# EAGLE design hand-pcb (EAGLE 7.3.0)
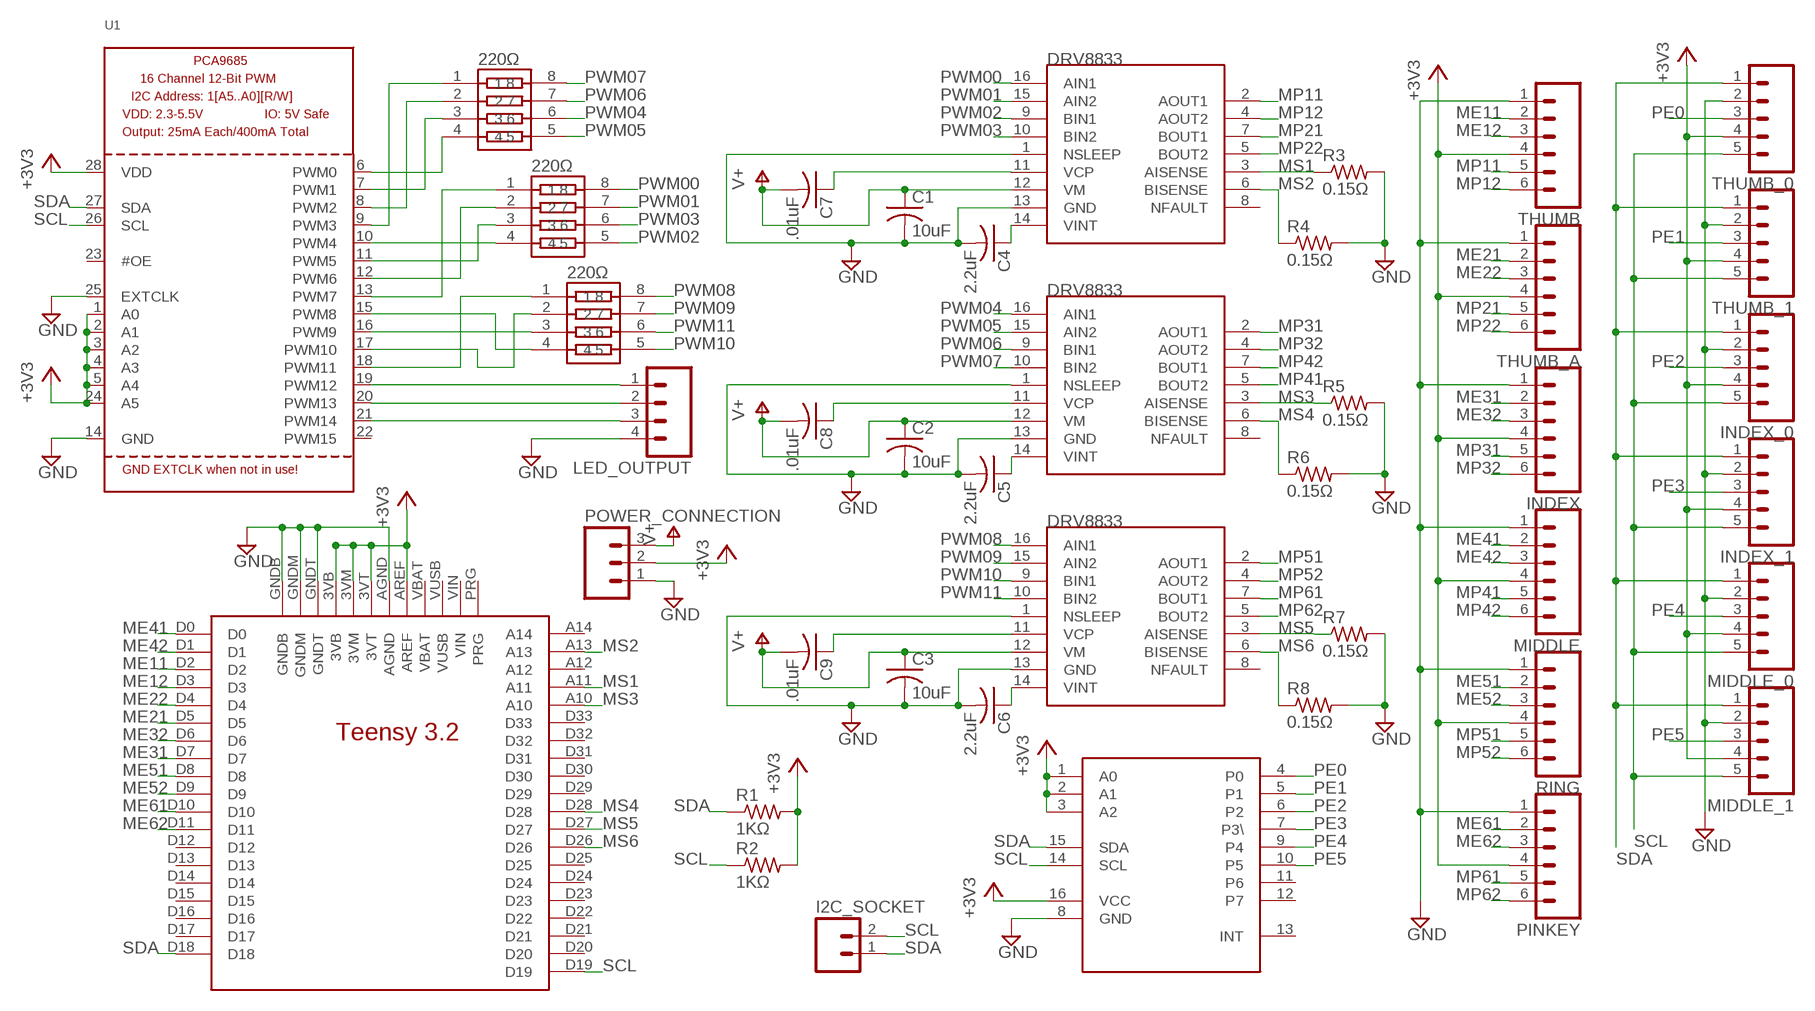
[diagram p0: schematic, sheet 1]

## Parts
220Ω  220Ω  RP164PJ221CS  [RP164PJ221CS]
C1  10uF  C-USC0603  [C0603]
C2  10uF  C-USC0603  [C0603]
C3  10uF  C-USC0603  [C0603]
C4  2.2uF  C-USC0603  [C0603]
C5  2.2uF  C-USC0603  [C0603]
C6  2.2uF  C-USC0603  [C0603]
C7  .01uF  C-USC0603  [C0603]
C8  .01uF  C-USC0603  [C0603]
C9  .01uF  C-USC0603  [C0603]
I2C_SOCKET  M02PTH  [1X02]
INDEX  M06POGOPIN_HOLES_ONLY  [1X06_HOLES_ONLY]
INDEX_0  M05  [1X05_HOLES_ONLY]
INDEX_1  M05  [1X05_HOLES_ONLY]
LED_OUTPUT  M04PTH  [1X04]
MIDDLE  M06POGOPIN_HOLES_ONLY  [1X06_HOLES_ONLY]
MIDDLE_0  M05  [1X05_HOLES_ONLY]
MIDDLE_1  M05  [1X05_HOLES_ONLY]
PINKEY  M06POGOPIN_HOLES_ONLY  [1X06_HOLES_ONLY]
POWER_CONNECTION  M03PTH  [1X03]
R1  1KΩ  R-US_R0603  [R0603]
R2  1KΩ  R-US_R0603  [R0603]
R3  0.15Ω  R-US_M1206  [M1206]
R4  0.15Ω  R-US_M1206  [M1206]
R5  0.15Ω  R-US_M1206  [M1206]
R6  0.15Ω  R-US_M1206  [M1206]
R7  0.15Ω  R-US_M1206  [M1206]
R8  0.15Ω  R-US_M1206  [M1206]
RING  M06POGOPIN_HOLES_ONLY  [1X06_HOLES_ONLY]
THUMB  M06POGOPIN_HOLES_ONLY  [1X06_HOLES_ONLY]
THUMB_0  M05  [1X05_HOLES_ONLY]
THUMB_1  M05  [1X05_HOLES_ONLY]
THUMB_A  M06POGOPIN_HOLES_ONLY  [1X06_HOLES_ONLY]
U1  PCA9685  [TSSOP28]
U$1  DRV8833  [TSSOP16]
U$2  DRV8833  [TSSOP16]
U$3  DRV8833  [TSSOP16]
U$4  TEENSY32  [TEENSY32]
U$5  TCA9534TSS  [TSSOP16]
U$7  220Ω  RP164PJ221CS  [RP164PJ221CS]
U$8  220Ω  RP164PJ221CS  [RP164PJ221CS]

## Nets
+3V3: INDEX.4 INDEX_0.4 INDEX_1.4 MIDDLE.4 MIDDLE_0.4 MIDDLE_1.4 PINKEY.4 POWER_CONNECTION.2 R1.2 R2.2 RING.4 THUMB.4 THUMB_0.4 THUMB_1.4 THUMB_A.4 U1.1(A0) U1.2(A1) U1.3(A2) U1.4(A3) U1.5(A4) U1.24(A5) U1.28(VDD) U$4.3VB U$4.3VM U$4.3VT U$4.AREF U$5.1(A0) U$5.2(A1) U$5.3(A2) U$5.16(VCC)
GND: C1.2 C2.2 C3.2 C4.2 C5.2 C6.2 INDEX.1 INDEX_0.2 INDEX_1.2 LED_OUTPUT.4 MIDDLE.1 MIDDLE_0.2 MIDDLE_1.2 PINKEY.1 POWER_CONNECTION.1 R3.2 R4.2 R5.2 R6.2 R7.2 R8.2 RING.1 THUMB.1 THUMB_0.2 THUMB_1.2 THUMB_A.1 U1.14(GND) U1.25(EXTCLK) U$1.1(NSLEEP) U$1.13(GND) U$2.1(NSLEEP) U$2.13(GND) U$3.1(NSLEEP) U$3.13(GND) U$4.AGND U$4.GNDB U$4.GNDM U$4.GNDT U$5.8(GND)
ME11: THUMB.2 U$4.D2
ME12: THUMB.3 U$4.D3
ME21: THUMB_A.2 U$4.D5
ME22: THUMB_A.3 U$4.D4
ME31: INDEX.2 U$4.D7
ME32: INDEX.3 U$4.D6
ME41: MIDDLE.2 U$4.D0
ME42: MIDDLE.3 U$4.D1
ME51: RING.2 U$4.D8
ME52: RING.3 U$4.D9
ME61: PINKEY.2 U$4.D10
ME62: PINKEY.3 U$4.D11
MP11: THUMB.5 U$1.2(AOUT1)
MP12: THUMB.6 U$1.4(AOUT2)
MP21: THUMB_A.5 U$1.7(BOUT1)
MP22: THUMB_A.6 U$1.5(BOUT2)
MP31: INDEX.5 U$2.2(AOUT1)
MP32: INDEX.6 U$2.4(AOUT2)
MP41: MIDDLE.5 U$2.5(BOUT2)
MP42: MIDDLE.6 U$2.7(BOUT1)
MP51: RING.5 U$3.2(AOUT1)
MP52: RING.6 U$3.4(AOUT2)
MP61: PINKEY.5 U$3.7(BOUT1)
MP62: PINKEY.6 U$3.5(BOUT2)
MS1: R3.1 U$1.3(AISENSE) U$4.A11
MS2: R4.1 U$1.6(BISENSE) U$4.A13
MS3: R5.1 U$2.3(AISENSE) U$4.A10
MS4: R6.1 U$2.6(BISENSE) U$4.D28
MS5: R7.1 U$3.3(AISENSE) U$4.D27
MS6: R8.1 U$3.6(BISENSE) U$4.D26
N$1: 220Ω.4 U1.6(PWM0)
N$2: 220Ω.3 U1.7(PWM1)
N$3: 220Ω.2 U1.8(PWM2)
N$4: 220Ω.1 U1.9(PWM3)
N$5: U1.10(PWM4) U$7.4
N$6: U1.11(PWM5) U$7.3
N$7: U1.12(PWM6) U$7.2
N$8: U1.13(PWM7) U$7.1
N$9: U1.15(PWM8) U$8.4
N$10: U1.16(PWM9) U$8.3
N$11: U1.17(PWM10) U$8.2
N$12: U1.18(PWM11) U$8.1
N$14: C7.1 U$1.11(VCP)
N$15: C8.1 U$2.11(VCP)
N$16: C9.1 U$3.11(VCP)
N$17: LED_OUTPUT.1 U1.19(PWM12)
N$18: LED_OUTPUT.2 U1.20(PWM13)
N$19: LED_OUTPUT.3 U1.21(PWM14)
N$25: C4.1 U$1.14(VINT)
N$28: C5.1 U$2.14(VINT)
N$33: C6.1 U$3.14(VINT)
PE0: THUMB_0.3 U$5.4(P0)
PE1: THUMB_1.3 U$5.5(P1)
PE2: INDEX_0.3 U$5.6(P2)
PE3: INDEX_1.3 U$5.7(P3\)
PE4: MIDDLE_0.3 U$5.9(P4)
PE5: MIDDLE_1.3 U$5.10(P5)
PWM00: U$1.16(AIN1) U$7.8
PWM01: U$1.15(AIN2) U$7.7
PWM02: U$1.9(BIN1) U$7.5
PWM03: U$1.10(BIN2) U$7.6
PWM04: 220Ω.6 U$2.16(AIN1)
PWM05: 220Ω.5 U$2.15(AIN2)
PWM06: 220Ω.7 U$2.9(BIN1)
PWM07: 220Ω.8 U$2.10(BIN2)
PWM08: U$3.16(AIN1) U$8.8
PWM09: U$3.15(AIN2) U$8.7
PWM10: U$3.9(BIN1) U$8.5
PWM11: U$3.10(BIN2) U$8.6
SCL: I2C_SOCKET.2 INDEX_0.5 INDEX_1.5 MIDDLE_0.5 MIDDLE_1.5 R2.1 THUMB_0.5 THUMB_1.5 U1.26(SCL) U$4.D19 U$5.14(SCL)
SDA: I2C_SOCKET.1 INDEX_0.1 INDEX_1.1 MIDDLE_0.1 MIDDLE_1.1 R1.1 THUMB_0.1 THUMB_1.1 U1.27(SDA) U$4.D18 U$5.15(SDA)
V+: C1.1 C2.1 C3.1 C7.2 C8.2 C9.2 POWER_CONNECTION.3 U$1.12(VM) U$2.12(VM) U$3.12(VM)
Unconnected: U1.22(PWM15) U1.23(#OE) U$1.8(NFAULT) U$2.8(NFAULT) U$3.8(NFAULT) U$4.A12 U$4.A14 U$4.D12 U$4.D13 U$4.D14 U$4.D15 U$4.D16 U$4.D17 U$4.D20 U$4.D21 U$4.D22 U$4.D23 U$4.D24 U$4.D25 U$4.D29 U$4.D30 U$4.D31 U$4.D32 U$4.D33 U$5.11(P6) U$5.12(P7) U$5.13(INT)

## Power pins joined to a net without a drawn wire
PRG: U$4.PRG
VBAT: U$4.VBAT
VIN: U$4.VIN
VUSB: U$4.VUSB

## Library data of the parts
220Ω U$7 U$8 = resistor-net1:RP164PJ221CS
C1-C9 = resistor:C-US: CAPACITOR, American symbol
I2C_SOCKET = SparkFun1:M02: Header 2 Standard 2-pin 0.1" header. Use with straight break away headers (SKU : PRT-00116), right angle break away headers (PRT-00553), swiss pins (PRT-00743), machine pins (PRT-00117), and female headers (PRT-00115). Molex polarized connector foot print use with SKU : PRT-08233 with associated crimp pins and housings.
INDEX MIDDLE PINKEY RING THUMB THUMB_A = SparkFun:M06: Header 6 Standard 6-pin 0.1" header. Use with straight break away headers (SKU : PRT-00116), right angle break away headers (PRT-00553), swiss pins (PRT-00743), machine pins (PRT-00117), and female headers (PRT-00115). Molex polarized connector foot print use with SKU : PRT-08094 with associated crimp pins and housings. NOTES ON THE VARIANTS LOCK and LOCK_LONGPADS... This footprint was designed to help hold the alignment of a through-hole component (i.e. 6-pin header) while soldering it into place. You may notice that each hole has been shifted either up or down by 0.005 of an inch from it's more standard position (which is a perfectly straight line). This slight alteration caused the pins (the squares in the middle) to touch the edges of the holes. Because they are alternating, it causes a "brace" to hold the component in place. 0.005 has proven to be the perfect amount of "off-center" position when using our standard breakaway headers. Although looks a little odd when you look at the bare footprint, once you have a header in there, the alteration is very hard to notice. Also, if you push a header all the way into place, it is covered up entirely on the bottom side. This idea of altering the position of holes to aid alignment will be further integrated into the Sparkfun Library for other footprints. It can help hold any component with 3 or more connection pins.
INDEX_0 INDEX_1 MIDDLE_0 MIDDLE_1 THUMB_0 THUMB_1 = SparkFun1:M05: Header 5 Standard 5-pin 0.1" header. Use with straight break away headers (SKU : PRT-00116), right angle break away headers (PRT-00553), swiss pins (PRT-00743), machine pins (PRT-00117), and female headers (PRT-00115). Molex polarized connector foot print use with SKU : PRT-08230 with associated crimp pins and housings.
LED_OUTPUT = SparkFun1:M04: Header 4 Standard 4-pin 0.1" header. Use with straight break away headers (SKU : PRT-00116), right angle break away headers (PRT-00553), swiss pins (PRT-00743), machine pins (PRT-00117), and female headers (PRT-00115). Molex polarized connector foot print use with SKU : PRT-08231 with associated crimp pins and housings. 1MM SMD Version SKU: PRT-10208
POWER_CONNECTION = SparkFun1:M03: Header 3 Standard 3-pin 0.1" header. Use with straight break away headers (SKU : PRT-00116), right angle break away headers (PRT-00553), swiss pins (PRT-00743), machine pins (PRT-00117), and female headers (PRT-00115). Molex polarized connector foot print use with SKU : PRT-08232 with associated crimp pins and housings.
R1-R8 = resistor:R-US_: RESISTOR, American symbol
U1 = adafruit:PCA9685: PCA9685 - 16 Channel 12-Bit I2C PWM Controller 5.0V tolerant 16 channel, 12-bit I2C PWM controller with 25mA per output (max. 400mA total) Digikey: 568-5931-1-ND
U$1-U$3 = texas1:DRV8833
U$4 = SparkFun:TEENSY32
U$5 = texas1:TCA9534

## Board
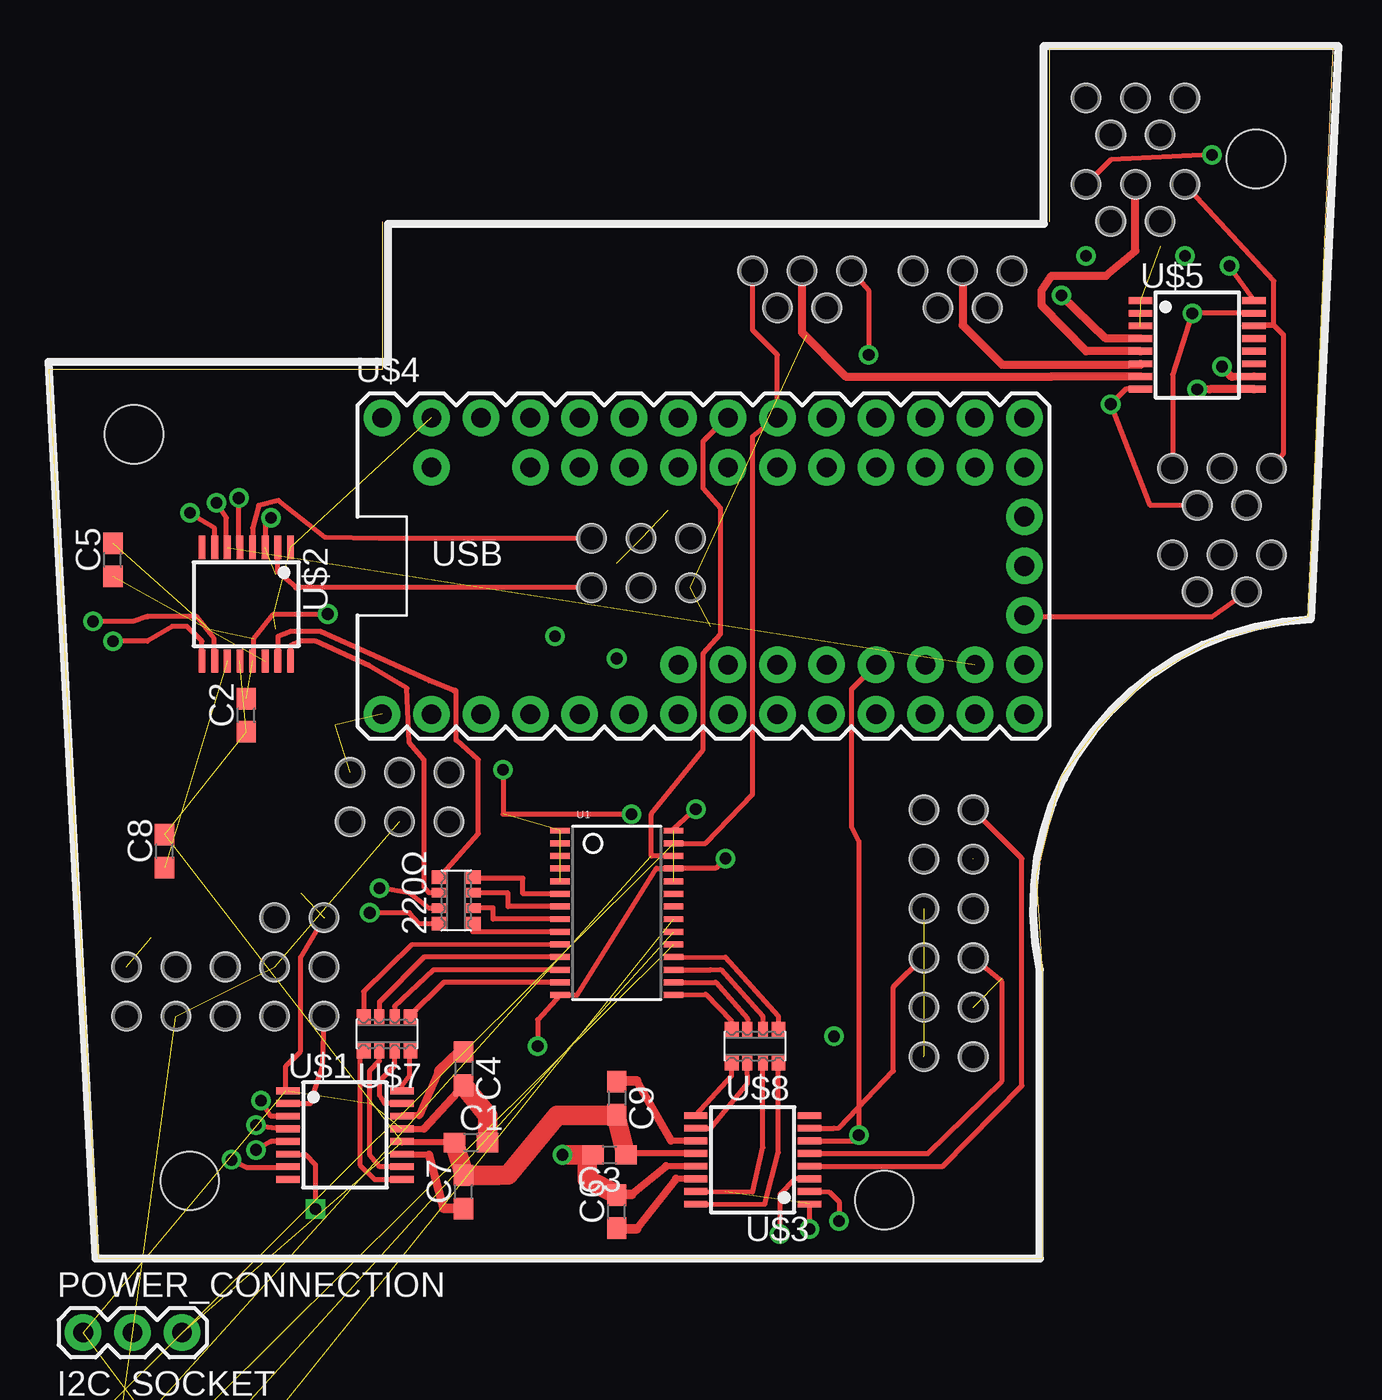
[diagram p1: board, top side]
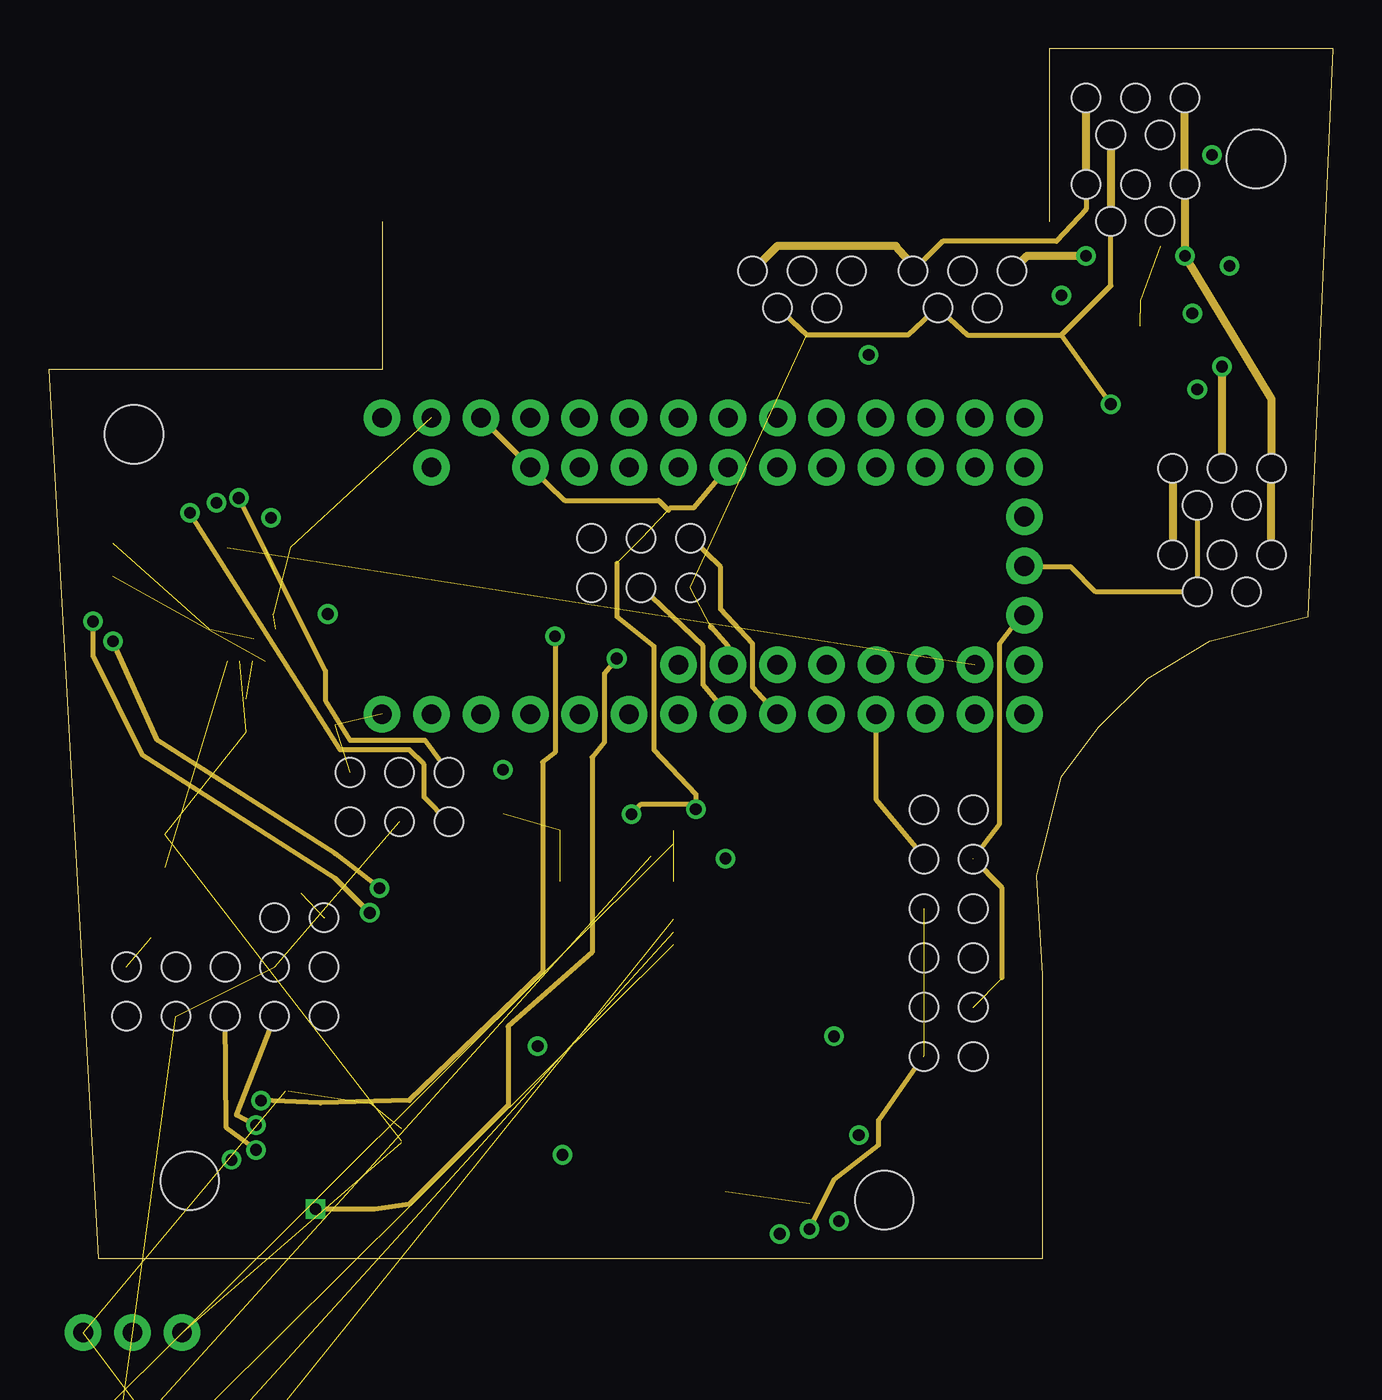
[diagram p2: board, inner layer Route2]
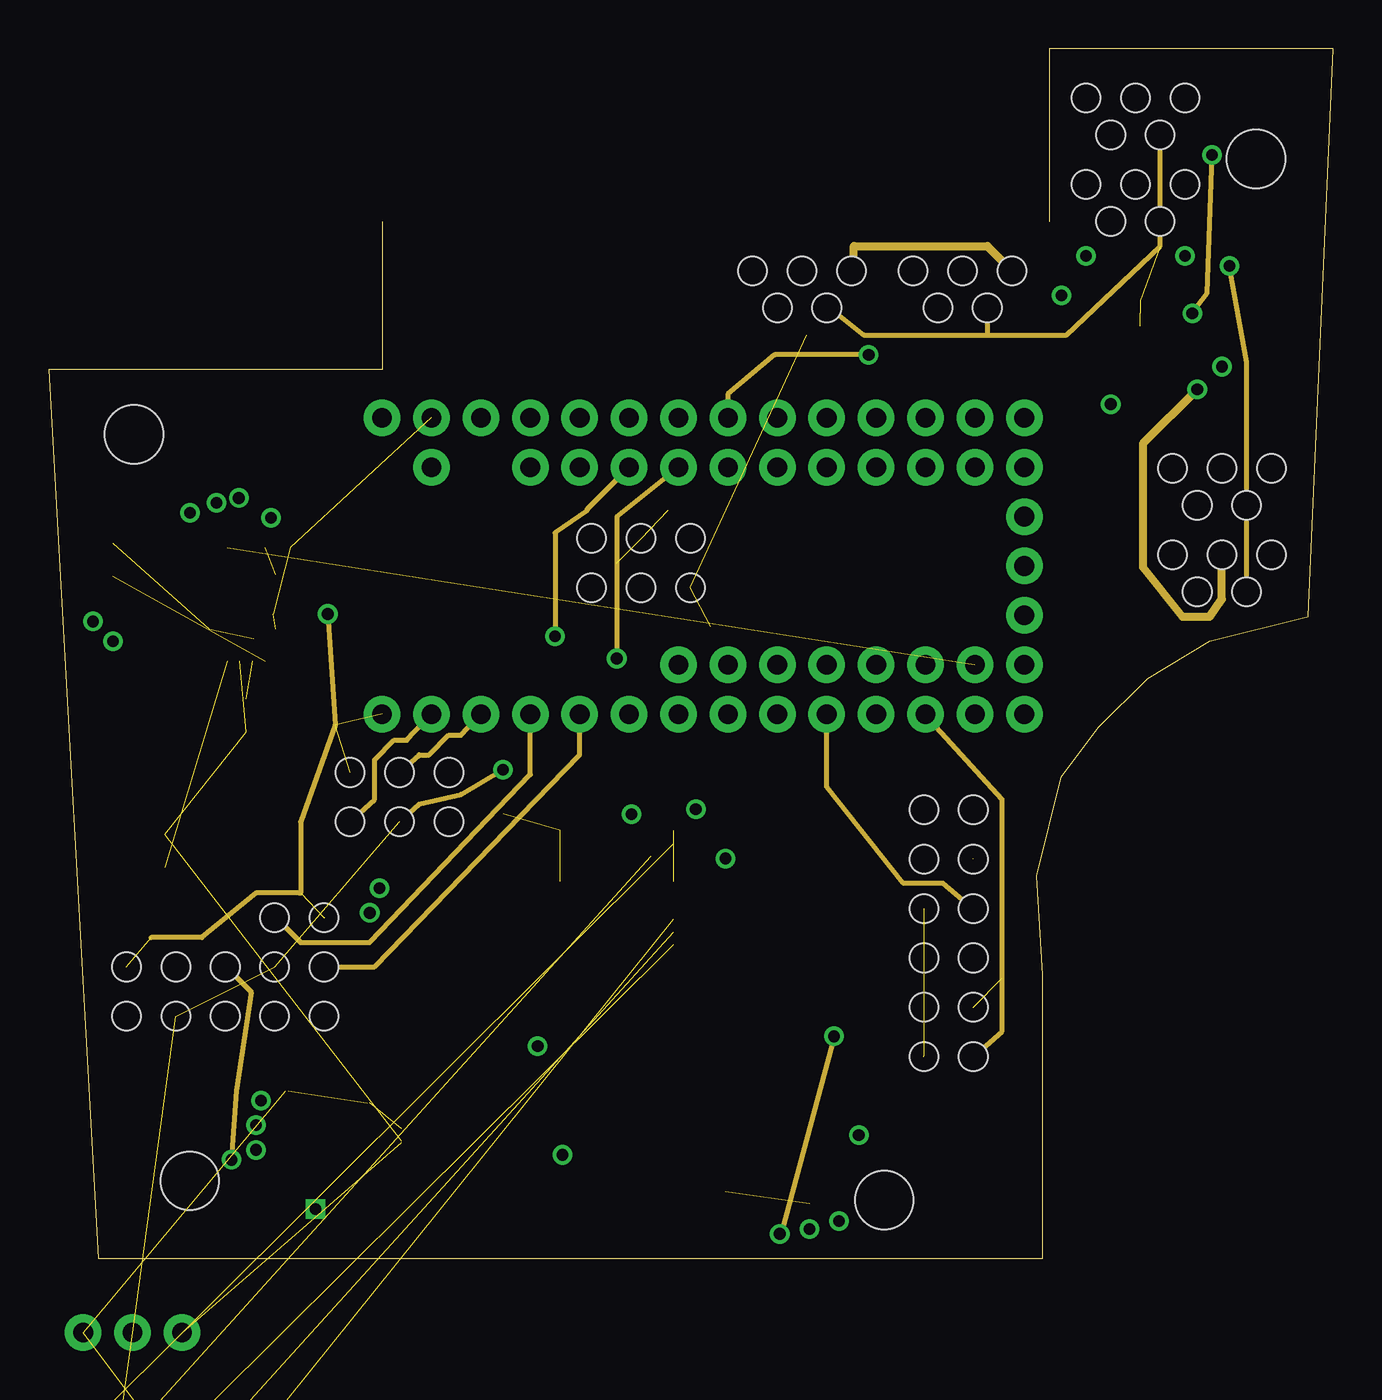
[diagram p3: board, inner layer Route3]
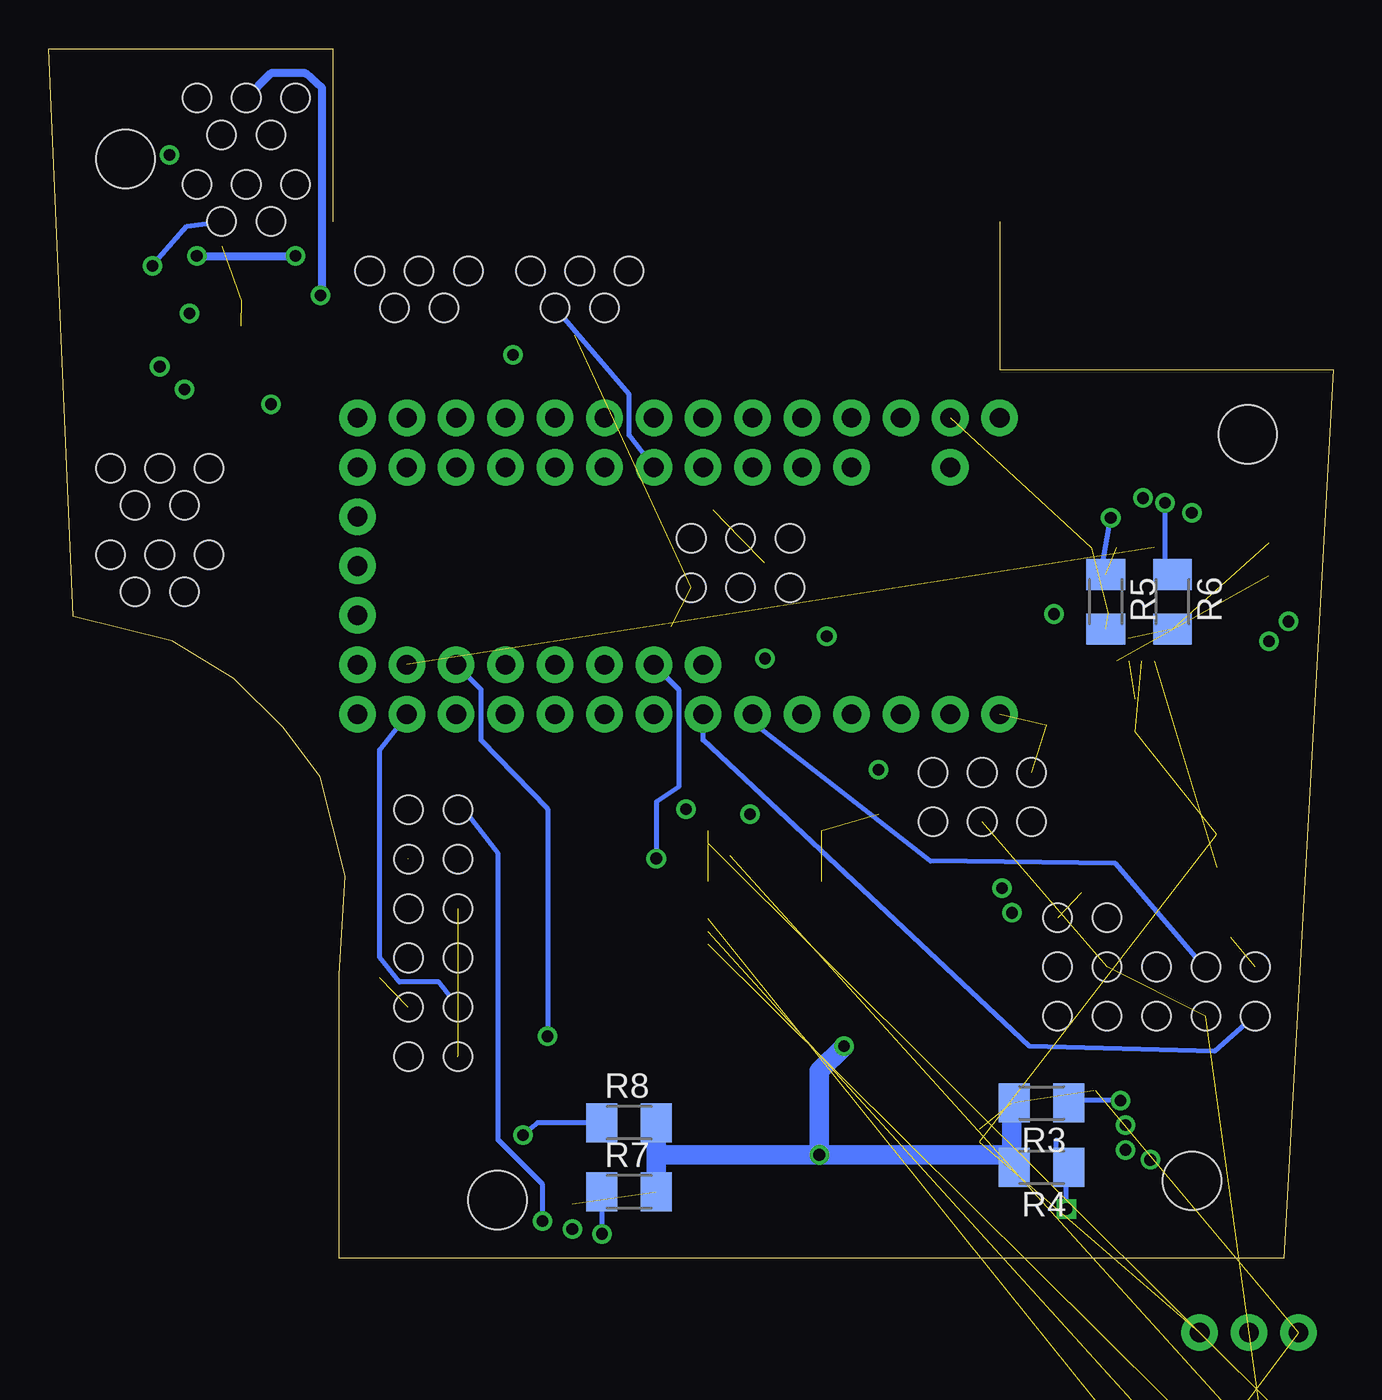
[diagram p4: board, bottom side, seen from below]

Size 66.04 x 62.23 mm. Coordinates in mm from the lower left corner, seen from the top.
Outline: 51.44,53.34 51.44,62.23 66.04,62.23 64.77,33.02 59.69,31.75 56.52,29.84 53.98,27.3 52.07,24.77 50.8,19.68 51.1,14.6 51.1,0 2.54,0 0,45.71 17.14,45.71 17.14,53.34
Copper layers (1*2*3*16): Top 0.035mm / dielectric 0.2mm / Route2 0.035mm / dielectric 0.2mm / Route3 0.035mm / dielectric 0.2mm / Bottom 0.035mm
Design rules "default *": minimum track width 10mil, minimum drill 24mil, track to track 8mil, track to pad 8mil, pad to pad 8mil, via to via 8mil, smd to smd 8mil, copper to edge 40mil, drill to drill 8mil, minimum pad ring 10mil, minimum via ring 8mil, stop-mask expansion 4mil, vias tented up to drill 0mil, thermal gap 10mil
Holes 3 mm at 4.39,42.39 7.26,4 42.96,3 62.08,56.56

### Footprints (pad centres in the part's own frame; a part is rotated, then mirrored left to right if it is on the bottom)
RP164PJ221CS = smd 0.7 x 0.8: 1 -1.2,-0.85; 4 1.2,-0.85; 5 1.2,0.85; 8 -1.2,0.85 | smd 0.5 x 0.8: 2 -0.4,-0.85; 3 0.4,-0.85; 6 0.4,0.85; 7 -0.4,0.85
C0603 = smd 1.1 x 1: 1 -0.85,0; 2 0.85,0
1X02 = drill 1.016 pad 1.88: 1 0,0; 2 2.54,0
1X06_HOLES_ONLY = drill 0.889 pad 0.813: 1 0,0; 2 0,-2.54; 3 2.54,0; 4 2.54,-2.54; 5 5.08,0; 6 5.08,-2.54 | hole 1.473: 0,0; 0,-2.54; 2.54,0; 2.54,-2.54; 5.08,0; 5.08,-2.54
1X05_HOLES_ONLY = drill 0.889 pad 0.813: 1 0,0; 2 1.27,-1.905; 3 2.54,0; 4 3.81,-1.905; 5 5.08,0 | hole 1.473: 0,0; 1.27,-1.905; 2.54,0; 3.81,-1.905; 5.08,0
1X04 = drill 1.016 pad 1.88 square: 1 0,0 | drill 1.016 pad 1.88: 2 2.54,0; 3 5.08,0; 4 7.62,0
1X03 = drill 1.016 pad 1.88: 1 0,0; 2 2.54,0; 3 5.08,0
R0603 = smd 1 x 1.1: 1 -0.85,0; 2 0.85,0
M1206 = smd 1.6 x 2: 1 -1.4,0; 2 1.4,0
TSSOP28 = smd 0.305 x 0.991: 1 -4.225,-2.918; 2 -3.575,-2.918; 3 -2.925,-2.918; 4 -2.275,-2.918; 5 -1.625,-2.918; 6 -0.975,-2.918; 7 -0.325,-2.918; 8 0.325,-2.918; 9 0.975,-2.918; 10 1.625,-2.918; 11 2.275,-2.918; 12 2.925,-2.918; 13 3.575,-2.918; 14 4.225,-2.918; 15 4.225,2.918; 16 3.575,2.918; 17 2.925,2.918; 18 2.275,2.918; 19 1.625,2.918; 20 0.975,2.918; 21 0.325,2.918; 22 -0.325,2.918; 23 -0.975,2.918; 24 -1.625,2.918; 25 -2.275,2.918; 26 -2.925,2.918; 27 -3.575,2.918; 28 -4.225,2.918
TSSOP16 = smd 0.35 x 1.2: 1 -2.275,-2.925; 2 -1.625,-2.925; 3 -0.975,-2.925; 4 -0.325,-2.925; 5 0.325,-2.925; 6 0.975,-2.925; 7 1.625,-2.925; 8 2.275,-2.925; 9 2.275,2.925; 10 1.625,2.925; 11 0.975,2.925; 12 0.325,2.925; 13 -0.325,2.925; 14 -0.975,2.925; 15 -1.625,2.925; 16 -2.275,2.925
TEENSY32 = drill 1.016 pad 1.88: 3VB 1.27,5.08; 3VM 16.51,-2.54; 3VT -11.43,7.62; A10 -6.35,5.08; A11 -3.81,5.08; A12 -1.27,-5.08; A13 -1.27,5.08; A14 16.51,5.08; AGND -13.97,7.62; AREF -8.89,5.08; D0 -13.97,-7.62; D1 -11.43,-7.62; D2 -8.89,-7.62; D3 -6.35,-7.62; D4 -3.81,-7.62; D5 -1.27,-7.62; D6 1.27,-7.62; D7 3.81,-7.62; D8 6.35,-7.62; D9 8.89,-7.62; D10 11.43,-7.62; D11 13.97,-7.62; D12 16.51,-7.62; D13 16.51,7.62; D14 13.97,7.62; D15 11.43,7.62; D16 8.89,7.62; D17 6.35,7.62; D18 3.81,7.62; D19 1.27,7.62; D20 -1.27,7.62; D21 -3.81,7.62; D22 -6.35,7.62; D23 -8.89,7.62; D24 3.81,-5.08; D25 6.35,-5.08; D26 8.89,-5.08; D27 11.43,-5.08; D28 13.97,-5.08; D29 13.97,5.08; D30 11.43,5.08; D31 8.89,5.08; D32 6.35,5.08; D33 3.81,5.08; GNDB 1.27,-5.08; GNDM 16.51,0; GNDT -16.51,-7.62; PRG 16.51,2.54; VBAT 16.51,-5.08; VIN -16.51,7.62; VUSB -13.97,5.08

### Placement (x,y rotation side)
220Ω  20.95,18.41 90 top
C1  21.72,5.97 0 top
C2  10.16,27.94 90 top
C3  28.83,5.33 180 top
C4  21.34,9.78 270 top
C5  3.3,35.94 90 top
C6  29.21,2.41 90 top
C7  21.34,3.43 90 top
C8  5.97,20.95 90 top
C9  29.21,8.26 270 top
I2C_SOCKET  1.78,-8.89 0 top  (outside the outline)
INDEX  33,34.5 180 top
INDEX_0  44.45,50.8 0 top
INDEX_1  36.2,50.8 0 top
LED_OUTPUT  1.78,-13.97 0 top  (outside the outline)
MIDDLE  15.5,25 0 top
MIDDLE_0  57.78,36.2 0 top
MIDDLE_1  57.78,40.64 0 top
PINKEY  45,10.38 90 top
POWER_CONNECTION  1.78,-3.81 0 top  (outside the outline)
R1  1.52,-17.78 0 top  (outside the outline)
R2  1.52,-21.34 0 top  (outside the outline)
R3  14.99,8 180 bottom
R4  14.99,4.7 180 bottom
R5  11.68,33.78 270 bottom
R6  8.26,33.78 270 bottom
R7  36.2,3.43 0 bottom
R8  36.2,6.99 0 bottom
RING  45,18 90 top
THUMB  14.16,17.54 270 top
THUMB_0  53.34,59.69 0 top
THUMB_1  53.34,55.24 0 top
THUMB_A  4,15 0 top
U1  29.21,17.78 270 top
U$1  15.24,6.35 270 top
U$2  10.16,33.66 180 top
U$3  36.2,5.08 90 top
U$4  33.66,35.62 0 top
U$5  59.05,46.99 270 top
U$7  17.4,11.56 180 top
U$8  36.32,10.92 180 top

### Tracks (layer width: path | path; a pad name or v marks a point on that pad's centre or on a via)
+3V3  (via drill 0.6)  (19 unrouted)
  Top 0.254: U$5.16 v60.71,51.04 v60.71,51.05 | U$4.3VM 50.29,33.08 50.29,33.02 59.82,33.02 MIDDLE_0.4 | v33.27,23.11 32.13,22.1 U1.28 | v23.37,25.15 23.37,22.86 v29.97,22.86
  Route2 0.254: 49.02,14.44 49.02,19.05 47.54,20.57 48.9,22.35 48.9,31.62 50.16,33.27 U$4.3VM | U$4.3VB 33.15,38.61 31.98,38.61 31.87,38.49 31.36,38.99 26.54,38.99 U$4.AREF U$4.3VT | 29.21,35.77 29.21,33.02 31.11,31.5 31.11,26.16 33.27,23.88 33.27,23.37 | v29.97,22.86 30.48,23.37 33.27,23.37 | 33.27,23.37 v33.27,23.11
  Route3 0.254: INDEX_1.4 40.13,48.9 41.91,47.5 48.26,47.5 | THUMB_0.4 THUMB_1.4 57.15,52.07 52.32,47.5 48.26,47.5 | MIDDLE_0.4 MIDDLE_1.4 61.59,46.1 v60.71,51.05 | INDEX_0.4 48.26,47.5 | v18.03,22.46 19.05,23.37 21.21,23.88 v23.37,25.15
  Bottom 0.254: v60.71,51.05 58.93,53.09 THUMB_1.4 | U$4.3VB 36.2,42.35 36.2,44.45 INDEX_1.4
GND  (via drill 0.6)  (20 unrouted)
  Top 0.254: U$5.8 55.37,44.72 v54.61,43.94 56.64,38.73 MIDDLE_1.2 | U$2.13 10.54,30.73 10.54,31.88 11.56,33.15 v14.35,33.15 | 29.21,3.3 C6.2 | 21.34,8.89 C4.2 | v25.15,10.92 25.15,12.29 U1.14 27.18,13.55 31.24,20.07 32.13,20.07 | 27.69,5.33 27.94,5.33 | U$1.1 12.19,8.62 12.19,9.91 12.95,10.67 12.95,15.49 14.16,17.53 | v34.8,20.57 34.29,20.07 32.13,20.07 | 32.13,20.07 U1.25 | U$3.1 v39.12,1.52
  Top 0.3: U$3.13 31.75,4.75 | U$1.13 19.3,6.67
  Top 0.4: 31.75,4.75 29.97,3.3 | 19.3,6.67 21.34,8.89
  Top 0.5: 29.97,3.3 29.21,3.3
  Top 1: C3.2 27.94,5.33 v26.42,5.33 | 29.21,3.3 27.69,4.06 27.69,5.33 | 21.34,8.89 22.57,7.37 C1.2
  Route2 0.254: 52.07,47.5 47.24,47.5 INDEX_0.2 44.2,47.5 38.99,47.5 INDEX_1.2 | 52.07,47.5 54.61,50.04 THUMB_1.2 | 52.07,47.5 v54.61,43.94 | MIDDLE_1.2 MIDDLE_0.2 53.85,34.29 52.58,35.56 50.16,35.56 U$4.GNDM | 34.04,32.47 34.04,32.51 34.92,31.5 U$4.GNDB | v39.12,1.52 40.39,4.06 42.67,5.84 42.67,7.11 45,10.41
  Route2 0.406: THUMB_0.2 THUMB_1.2
  Route3 0.254: 5.27,16.51 7.87,16.51 10.67,18.8 12.89,18.8 12.95,18.8 12.95,22.46 14.73,27.43 v14.35,33.15
  Bottom 0.254: R3.2 16.51,8 | 16.51,5.33 16.39,5.33 R4.2 | R8.2 34.8,5.33 | U$4.GNDB 33.66,29.27 33.66,24.26 34.8,23.5 v34.8,20.57 | 17.14,28.05 U$4.GNDT
  Bottom 1: 16.51,8 16.51,5.33 v26.42,5.33 | R8.2 R7.2 | 34.8,5.33 v26.42,5.33 | v25.15,10.92 26.42,9.65 v26.42,5.33
ME11
  Route3 0.254: THUMB.2 11.68,17.54 12.95,16.26 16.51,16.26 24.77,24.89 U$4.D2
ME12
  Route3 0.254: THUMB.3 16.76,15 27.3,25.91 U$4.D3
ME21
  Bottom 0.254: THUMB_A.2 4.06,12.46 4.06,12.45 6.1,10.67 15.62,10.92 32.38,26.67 U$4.D5
ME22
  Bottom 0.254: THUMB_A.3 6.6,15 6.6,14.99 11.18,20.32 20.7,20.45 29.84,27.56 U$4.D4
ME31
  Route2 0.254: U$4.D7 36.2,29.4 36.2,31.62 34.54,33.4 34.54,35.56 33,37.08 INDEX.2
ME32
  Route2 0.254: U$4.D6 33.66,29.52 33.66,31.5 30.46,34.54 INDEX.3
ME41
  Route3 0.254: MIDDLE.2 16.76,23.62 16.76,25.65 17.78,26.67 18.41,26.67 U$4.D0
ME42
  Route3 0.254: MIDDLE.3 19.05,25.91 19.56,25.91 20.57,26.92 21.21,26.92 U$4.D1
ME51
  Route3 0.254: RING.2 47.5,18 45.97,19.3 43.94,19.3 40.01,24.26 U$4.D8
ME52
  Route2 0.254: RING.3 45.09,20.54 42.55,23.62 U$4.D9
ME61
  Route3 0.254: PINKEY.2 49.02,11.68 49.02,23.62 45.09,27.94 U$4.D10
ME62
  Bottom 0.254: PINKEY.3 44.96,12.92 45.97,14.22 48.01,14.22 49.02,15.49 49.02,26.16 47.62,27.94 U$4.D11
MP11
  Top 0.254: U$1.2 13.46,7.97 14.1,9.91 14.16,12.45 THUMB.5
MP12  (via drill 0.6)
  Top 0.254: v10.67,6.86 11.68,6.73 12.82,6.73 U$1.4
  Route2 0.254: THUMB.6 9.65,7.38 v10.67,6.86
MP21  (via drill 0.6)
  Top 0.254: v9.4,5.08 10.16,4.7 12.31,4.7 U$1.7
  Route3 0.254: THUMB_A.5 9.14,15 10.41,13.72 9.65,8.64 v9.4,5.08
MP22  (via drill 0.6)
  Top 0.254: U$1.5 11.43,6.03 v10.67,5.59
  Route2 0.254: v10.67,5.59 9.14,6.73 9.08,12.45 THUMB_A.6
MP31
  Top 0.254: INDEX.5 12.7,34.5 12.7,34.54 11.79,35.31 U$2.2
MP32
  Top 0.254: INDEX.6 17.02,37.04 14.22,37.08 11.81,38.99 10.79,38.73 10.48,37.59 U$2.4
MP41  (via drill 0.6)
  Top 0.254: U$2.5 9.78,36.58 v9.78,39.12
  Route2 0.254: v9.78,39.12 14.22,30.23 14.22,28.7 15.49,26.67 19.35,26.67 MIDDLE.5
MP42  (via drill 0.6)
  Top 0.254: v7.26,38.35 8.51,37.59 U$2.7
  Route2 0.254: MIDDLE.6 19.3,23.73 19.3,25.4 18.54,26.16 14.99,26.16 v7.26,38.35
MP51  (via drill 0.6)
  Top 0.254: U$3.2 40.13,3.43 40.64,2.92 v40.64,1.93
  Bottom 0.254: v40.64,1.93 40.64,3.81 42.93,6.1 42.93,20.83 44.7,23.11 45,23.11 RING.5
MP52
  Top 0.254: RING.6 47.54,23.11 47.5,23.11 50.04,20.57 50.04,8.89 45.97,4.75 U$3.4
MP61
  Top 0.254: U$3.7 40.39,6.71 40.64,6.73 43.43,9.65 43.43,13.97 44.96,15.49 45,15.49 PINKEY.5
MP62
  Top 0.254: U$3.5 45.21,5.41 49.02,9.14 49.02,14.22 47.5,15.49 47.54,15.49 PINKEY.6
MS1  (via drill 0.6)
  Top 0.254: U$1.3 11.43,7.33 v10.92,8.13
  Route2 0.254: v26.04,32 26.04,26.04 25.4,25.53 25.4,14.73 18.54,8.13 13.97,8 v10.92,8.13 10.92,8 v10.92,8.13
  Route3 0.254: U$4.A11 27.69,38.54 27.69,38.48 26.04,37.34 v26.04,32
  Bottom 0.254: v10.92,8.13 13.59,8.13 R3.1
MS2  (via drill 0.6)
  Top 0.254: U$1.6 13.21,5.33 13.72,4.83 v13.72,2.54
  Route2 0.254: v29.21,30.86 28.57,30.1 28.57,26.54 27.94,25.78 27.94,15.75 23.62,11.94 23.62,7.87 18.54,2.79 16.76,2.54 v13.72,2.54
  Route3 0.254: v29.21,30.86 29.21,38.16 U$4.A13
  Bottom 0.254: v13.72,2.54 13.72,4.83 13.59,4.83 R4.1 14.22,4.7 14.22,6.1
MS3  (via drill 0.6)  (1 unrouted)
  Top 0.254: U$2.3 11.18,36.58 11.18,37.85 v11.43,38.1
  Bottom 0.254: R5.1 11.94,35.18 v11.43,38.1
MS4  (via drill 0.6)  (1 unrouted)
  Top 0.254: U$2.6 9.14,36.58 9.14,38.1 v8.64,38.86
  Bottom 0.254: R6.1 8.64,35.18 v8.64,38.86
MS5  (via drill 0.6)
  Top 0.254: U$3.3 38.35,4.11 37.59,3.3 v37.59,1.27
  Route3 0.254: v40.39,11.43 37.59,1.02 v37.59,1.27
  Bottom 0.254: R7.1 v37.59,1.27 | U$4.D27 43.81,29.27 43.81,26.67 40.39,23.11 v40.39,11.43
MS6  (via drill 0.6)
  Top 0.254: U$3.6 41.4,6.05 v41.66,6.35 41.66,21.46 41.27,22.23 41.27,29.27 U$4.D26
  Bottom 0.254: R8.1 40.89,6.99 v41.66,6.35
N$1
  Top 0.254: U1.6 24.38,18.75 24.38,19.56 21.8,19.56 220Ω.4
N$2
  Top 0.254: U1.7 23.62,18.11 23.62,18.8 21.8,18.8 220Ω.3
N$3
  Top 0.254: U1.8 22.86,17.45 22.86,18.03 21.8,18.03 220Ω.2
N$4
  Top 0.254: U1.9 21.8,16.8 220Ω.1
N$5
  Top 0.254: U1.10 26.16,16.16 18.67,16.13 16.2,13.72 U$7.4
N$6
  Top 0.254: U1.11 19.3,15.51 17.02,13.21 17,13.21 U$7.3
N$7
  Top 0.254: U1.12 19.81,14.86 17.78,12.95 17.8,12.95 U$7.2
N$8
  Top 0.254: U1.13 20.32,14.21 18.54,12.45 18.6,12.45 U$7.1
N$9
  Top 0.254: U1.15 32.26,13.55 33.78,13.59 35.12,12.19 U$8.4
N$10
  Top 0.254: U1.16 34.29,14.21 35.94,12.32 35.92,11.94 U$8.3
N$11
  Top 0.254: U1.17 34.04,14.86 34.54,14.86 36.72,12.45 U$8.2
N$12
  Top 0.254: U1.18 32.26,15.51 34.8,15.49 37.52,12.45 U$8.1
N$14
  Top 0.254: 18.16,5.33 U$1.11
  Top 0.3: 19.56,5.33 18.16,5.33
  Top 0.4: 20.32,2.58 19.56,5.33
  Top 0.5: C7.1 20.32,2.58
N$15  (1 unrouted)
N$16
  Top 0.254: 29.21,9.14 C9.1
  Top 0.3: U$3.11 32,6.05
  Top 0.4: 32,6.05 30.23,9.14
  Top 0.5: 30.23,9.14 29.21,9.14
N$17  (1 unrouted)
N$18  (1 unrouted)
N$19  (1 unrouted)
N$25
  Top 0.254: C4.1 21.08,10.63 | 18.16,7.37 U$1.14
  Top 0.3: 19.05,7.37 18.16,7.37
  Top 0.4: 20.07,9.65 19.05,7.37
  Top 0.5: 21.08,10.63 20.07,9.65
N$28  (1 unrouted)
N$33
  Top 0.254: 29.21,1.52 C6.1
  Top 0.3: U$3.14 32.26,4.11
  Top 0.4: 32.26,4.11 30.23,1.52
  Top 0.5: 30.23,1.52 29.21,1.52
PE0  (via drill 0.6)
  Top 0.406: U$5.4 54.36,47.31 v52.07,49.53
  Bottom 0.406: THUMB_0.3 54.61,60.96 52.83,60.96 51.97,60.2 51.97,49.53 v52.07,49.53
PE1
  Top 0.406: U$5.5 53.34,46.66 51.05,49.02 51.05,49.78 51.56,50.55 54.36,50.55 55.88,51.82 THUMB_1.3
PE2
  Top 0.406: INDEX_0.3 46.99,48.01 49.02,45.97 56.13,45.97 U$5.6
PE3
  Top 0.406: U$5.7 51.56,45.37 51.56,45.34 41.02,45.34 38.73,47.62 INDEX_1.3
PE4  (via drill 0.6)
  Top 0.406: U$5.9 59.69,44.72 v59.05,44.7
  Route3 0.406: v59.05,44.7 56.26,41.91 56.26,35.56 58.29,33.02 59.69,33.02 60.33,33.91 MIDDLE_0.3
PE5  (via drill 0.6)
  Top 0.406: U$5.10 60.83,45.34 v60.33,45.87
  Route2 0.406: v60.33,45.87 MIDDLE_1.3
PWM00
  Top 0.254: U$7.8 18.54,10.71 18.54,9.4 18.16,8.89 U$1.16
PWM01
  Top 0.254: U$1.15 17.27,7.97 17.02,8.38 17.02,9.14 17.8,9.91 U$7.7
PWM02
  Top 0.254: U$7.5 16,10.45 16,4.83 16.76,4.06 U$1.9
PWM03
  Top 0.254: U$1.10 17.02,4.72 16.51,5.33 16.51,9.65 17,10.16 U$7.6
PWM04
  Top 0.254: U$2.16 12.44,31.5 12.95,31.75 13.72,31.75 16.51,30.48 18.41,29.34 18.53,26.54 19.3,25.65 19.3,19.11 19.56,18.82 220Ω.6
PWM05
  Top 0.254: 220Ω.5 20.07,19.61 20.07,19.56 22.1,21.84 22.1,25.65 20.95,26.67 20.95,29.21 20.83,29.21 19.56,29.72 13.97,32.26 12.45,32.26 11.79,32 U$2.15
PWM06  (via drill 0.6)
  Top 0.254: U$2.9 7.87,31.75 7.11,32.51 6.35,32.51 5.08,31.75 v3.3,31.75 | 220Ω.7 19.56,18.02 18.54,18.8 v17.02,19.05
  Route2 0.254: v17.02,19.05 14.73,20.83 5.59,26.67 v3.3,31.75
PWM07  (via drill 0.6)
  Top 0.254: U$2.10 8.51,30.73 8.51,31.88 7.62,33.02 5.08,33.02 4.32,32.77 v2.29,32.77 | 220Ω.8 19.05,17.21 18.54,17.78 v16.51,17.78
  Route2 0.254: v16.51,17.78 14.73,19.56 4.83,25.91 2.29,30.99 v2.29,32.77
PWM08
  Top 0.254: U$3.16 36.83,2.79 37.52,5.46 U$8.8
PWM09
  Top 0.254: U$3.15 36.2,3.43 36.72,5.71 U$8.7
PWM10
  Top 0.254: U$3.9 35.12,9.39 U$8.5
PWM11
  Top 0.254: U$3.10 34.04,6.71 35.94,9.02 35.92,9.91 U$8.6
SCL  (via drill 0.6)  (2 unrouted)
  Top 0.254: U$5.14 61.47,47.97 62.99,48.01 | 62.99,48.01 62.99,50.29 THUMB_1.5 | MIDDLE_1.5 63.5,41.4 63.5,47.5 62.99,48.01 | 62.99,48.01 61.98,48.01 | U1.26 30.99,20.7 30.99,22.86 33.66,26.16 33.66,31.11 34.54,32.13 34.54,38.61 33.66,39.62 33.66,42.04 34.92,43.31 U$4.D19 | INDEX_1.5 42.16,49.78 v42.16,46.48
  Route2 0.406: MIDDLE_0.5 MIDDLE_1.5 62.87,44.2 v58.42,51.56 THUMB_1.5 THUMB_0.5 | v53.34,51.56 50.29,51.56 INDEX_0.5
  Route3 0.254: v42.16,46.48 37.34,46.48 34.92,44.45 U$4.D19
  Route3 0.406: INDEX_1.5 41.4,50.8 41.4,52.07 48.26,52.07 INDEX_0.5
  Bottom 0.406: v58.42,51.56 v53.34,51.56
SDA  (via drill 0.6)  (2 unrouted)
  Top 0.254: MIDDLE_1.1 57.78,45.47 v58.8,48.62 U$5.15 | v59.82,56.77 54.61,56.52 THUMB_1.1 | U1.27 33.78,21.36 36.2,23.88 36.2,42.29 37.47,43.31 U$4.D18 37.47,46.48 36.2,47.75 INDEX_1.1
  Route2 0.254: THUMB_1.1 53.34,53.98 51.82,52.32 45.97,52.32 INDEX_0.1
  Route2 0.406: MIDDLE_1.1 MIDDLE_0.1 | THUMB_1.1 THUMB_0.1 | INDEX_0.1 44.45,51.05 43.56,52.07 37.47,52.07 INDEX_1.1
  Route3 0.254: v58.8,48.62 58.8,48.64 59.56,49.66 v59.82,56.77
V+  (4 unrouted)
  Top 0.254: 29.68,5.41 C3.1 | 18.16,5.97 U$1.12 | 29.21,7.37 C9.2
  Top 0.3: U$3.12 29.68,5.41 | C1.1 18.16,5.97
  Top 1: C9.2 29.17,7.41 C3.1 | C1.1 21.38,4.28 C7.2 23.11,4.28 23.62,4.32 26.16,7.37 29.21,7.37